# EAGLE schematic motherBoard_Power (EAGLE 9.3.0)

## Sheet 1 of 2
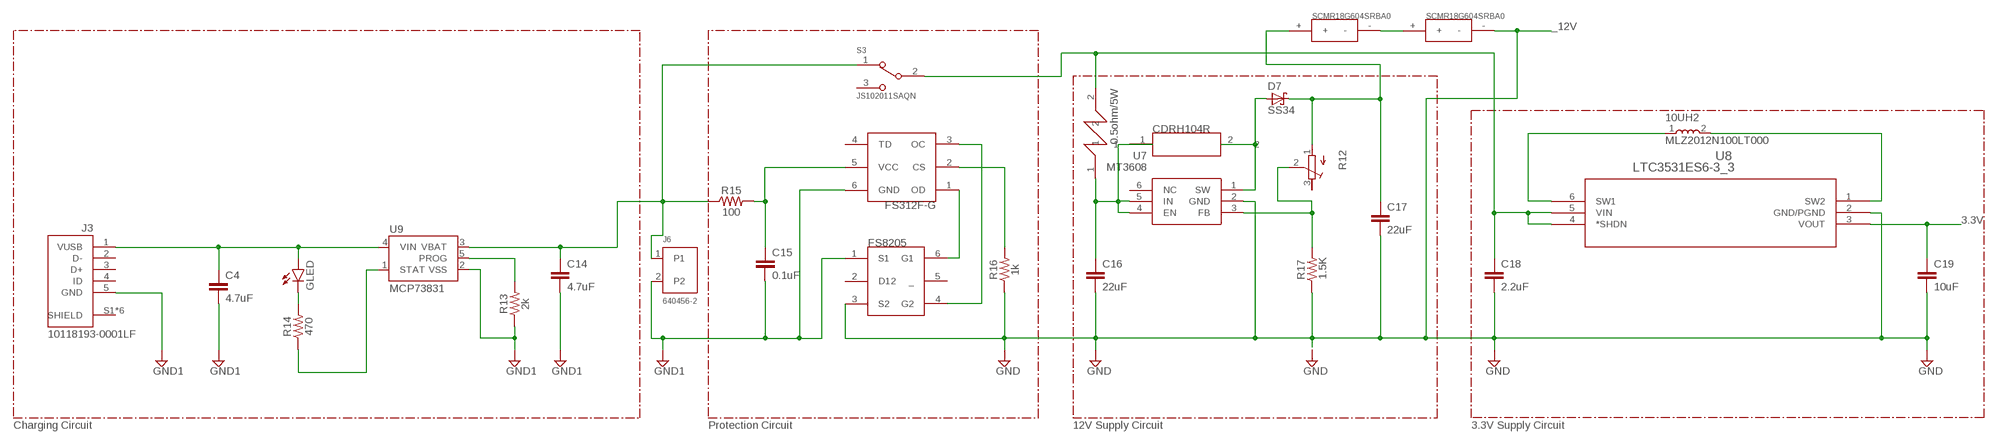
[diagram p0: schematic, sheet 1]

### Parts
10UH2  MLZ2012N100LT000  [INDC2012X125]
C4  4.7uF  10UF-0603-6.3V-20%  [0603]
C14  4.7uF  0.1UF-0603-25V-(+80/-20%)  [0603]
C15  0.1uF  0.1UF-0603-25V-(+80/-20%)  [0603]
C16  22uF  10UF-0603-6.3V-20%  [0603]
C17  22uF  10UF-0603-6.3V-20%  [0603]
C18  2.2uF  2.2UF-0603-10V-20%  [0603]
C19  10uF  10UF-0603-6.3V-20%  [0603]
D7  SS34  [SMB]
GLED  LED5MM  [LED5MM]
J3  10118193-0001LF  [FCI_10118193-0001LF]
J6  640456-2  [TE_640456-2]
R12  R-TRIMM3296P  [RTRIM3296P]
R13  2k  RESISTOR0805  [0805]
R14  470  RESISTOR0603  [0603]
R15  100  RESISTOR0603  [0603]
R16  1k  RESISTOR0603  [0603]
R17  1.5K  RESISTOR0603  [0603]
S3  JS102011SAQN  [SW_JS102011SAQN]
U7  MT3608  [SOT95P280X145-6N]
U8  LTC3531ES6-3_3  [TSOT-23_S6]
U9  MCP73831  [SOT23-5]
U$11  CDRH104R  [220-INDUCTOR]
U$12  FS312F-G  [SOT-23-6]
U$13  FS8205  [SOT-23-6]
U$14  SCMR18G604SRBA0  [SUPERCAP]
U$15  SCMR18G604SRBA0  [SUPERCAP]
U$16  WNER50FET  [RESISTOR]

### Nets
3.3V: C19.1 U8.3(VOUT)
12V1: C17.1 D7.C R12.1(E) U$14.+
_12V: C4.2 C14.2 C15.2 C16.2 C17.2 C18.2 C19.2 J3.5(GND) J6.2 R13.1 R16.1 R17.1 U7.2(GND) U8.2(GND/PGND) U9.2(VSS) U$12.6(GND) U$13.1(S1) U$13.3(S2) U$15.- ; supply symbol labelled GND1, GND
N$14: C15.1 R15.2 U$12.5(VCC)
N$18: C4.1 GLED.A J3.1(VUSB) U9.4(VIN)
N$25: D7.A U7.1(SW) U$11.2
N$26: R12.2(S) R17.2 U7.3(FB)
N$45: 10UH2.1 U8.6(SW1)
N$46: 10UH2.2 U8.1(SW2)
N$47: C18.1 S3.2 U8.4(*SHDN) U8.5(VIN) U$16.2
N$48: R14.1 U9.1(STAT)
N$49: C14.1 J6.1 R15.1 S3.1 U9.3(VBAT)
N$50: R13.2 U9.5(PROG)
N$51: R16.2 U$12.2(CS)
N$52: U$12.1(OD) U$13.6(G1)
N$53: U$12.3(OC) U$13.4(G2)
N$54: GLED.K(C) R14.2
N$55: U$14.- U$15.+
N$56: C16.1 U7.4(EN) U7.5(IN) U$11.1 U$16.1
Unconnected: J3.2(D-) J3.3(D+) J3.4(ID) J3.S1(SHIELD) J3.S2(SHIELD) J3.S3(SHIELD) J3.S4(SHIELD) J3.S5(SHIELD) J3.S6(SHIELD) R12.3(A) S3.3 U7.6(NC) U$12.4(TD) U$13.2(D12) U$13.5(_)

### Notes on the sheet
- Charging Circuit | Protection Circuit | 12V Supply Circuit | 3.3V Supply Circuit

## Sheet 2 of 2
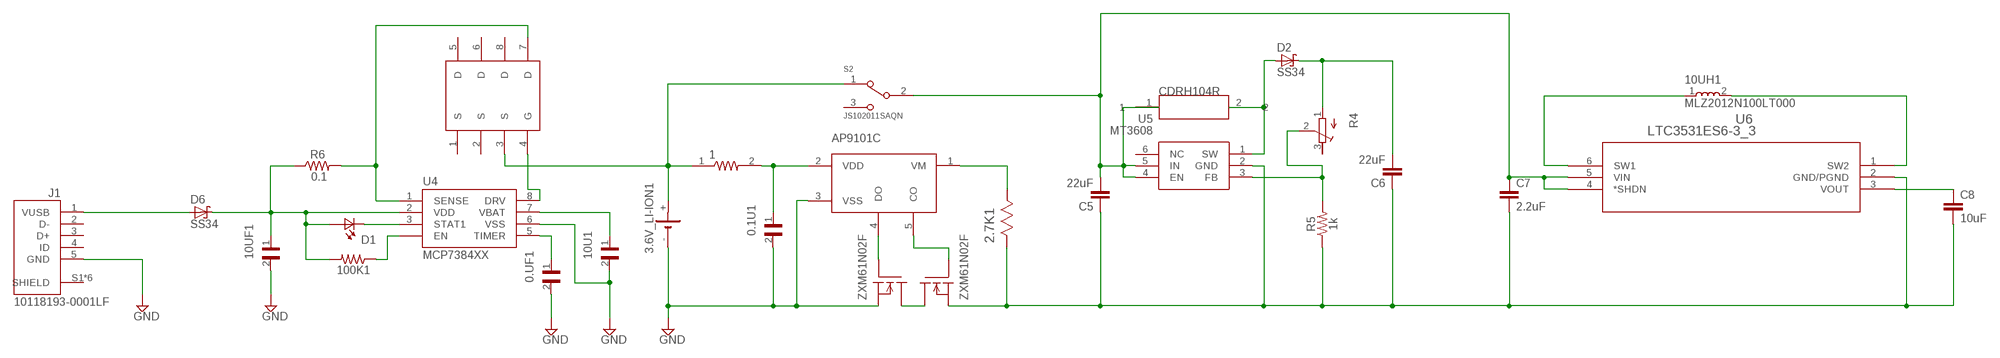
[diagram p1: schematic, sheet 2]

### Parts
0.1U1  C0805C104K4RACTU  [CAPC2012X88N]
0.UF1  C0805C104K4RACTU  [CAPC2012X88N]
1  ERJP6WF3300V  [RESC2012X70]
2.7K1  ERA-6AEB272V  [RESC2013X65N]
3.6V_LI-ION1  SL-160AA/PR  [SL-160AA/PR]
10U1  GRM21BC81C106KE15L  [CAPC2012X135N]
10UF1  GRM21BC81C106KE15L  [CAPC2012X135N]
10UH1  MLZ2012N100LT000  [INDC2012X125]
100K1  CRGH0805J100K  [RESC2012X65N]
C5  22uF  22NF/22,000PF-0603-50V-10%  [0603]
C6  22uF  22NF/22,000PF-0603-50V-10%  [0603]
C7  2.2uF  2.2UF-0603-10V-20%  [0603]
C8  10uF  10UF-0603-6.3V-20%  [0603]
D1  LTST-C191KGKT  [0603]
D2  SS34  [SMB]
D6  SS34  [SMB]
J1  10118193-0001LF  [FCI_10118193-0001LF]
R4  R-TRIMM3296P  [RTRIM3296P]
R5  1k  1KOHM-0603-1/10W-1%  [0603]
R6  0.1  RESISTOR0805  [0805]
S2  JS102011SAQN  [SW_JS102011SAQN]
U4  MCP7384XX  [MSOP8]
U5  MT3608  [SOT95P280X145-6N]
U6  LTC3531ES6-3_3  [TSOT-23_S6]
U$2  NDS8434  [SO08]
U$7  AP9101C  [SOT23-5]
U$8  ZXM61N02F  [SOT23W]
U$9  ZXM61N02F  [SOT23W]
U$10  CDRH104R  [220-INDUCTOR]

### Nets
GND: 0.1U1.2 0.UF1.2 3.6V_LI-ION1.- 10U1.2 10UF1.2 J1.5(GND) U4.6(VSS) U$7.3(VSS) U$8.2(S)
N$1: 10UF1.1 100K1.2 D1.2(A2) D6.C R6.1 U4.2(VDD)
N$13: D1.1(K2) U4.3(STAT1)
N$15: 100K1.1 U4.4(EN)
N$16: R6.2 U4.1(SENSE) U$2.7(D)
N$27: 0.UF1.1 U4.5(TIMER)
N$28: 10U1.1 U4.7(VBAT)
N$29: 1.1 3.6V_LI-ION1.+ S2.1 U$2.3(S)
N$30: U4.8(DRV) U$2.4(G)
N$31: 0.1U1.1 1.2 U$7.2(VDD)
N$32: U$8.3(D) U$9.3(D)
N$33: U$7.4(DO) U$8.1(G)
N$34: U$7.5(CO) U$9.1(G)
N$35: 2.7K1.1(R1) U$7.1(VM)
N$36: 2.7K1.2(R2) C5.1 C6.1 C7.2 C8.2 R5.1 U5.2(GND) U6.2(GND/PGND) U$9.2(S)
N$37: D6.A J1.1(VUSB)
N$38: D2.A U5.1(SW) U$10.2
N$39: R4.2(S) R5.2 U5.3(FB)
N$40: C6.2 D2.C R4.1(E)
N$41: 10UH1.1 U6.6(SW1)
N$42: 10UH1.2 U6.1(SW2)
N$43: C5.2 C7.1 S2.2 U5.4(EN) U5.5(IN) U6.4(*SHDN) U6.5(VIN) U$10.1
N$44: C8.1 U6.3(VOUT)
Unconnected: J1.2(D-) J1.3(D+) J1.4(ID) J1.S1(SHIELD) J1.S2(SHIELD) J1.S3(SHIELD) J1.S4(SHIELD) J1.S5(SHIELD) J1.S6(SHIELD) R4.3(A) S2.3 U5.6(NC) U$2.1(S) U$2.2(S) U$2.5(D) U$2.6(D) U$2.8(D)

## Library data of the parts
0.1U1 0.UF1 = C0805C104K4RACTU:C0805C104K4RACTU: Ceramic Multilayer Capacitor; Capacitor Type:General Purpose; Capacitance:0.01µF; Capacitance Tolerance:± 10%; Voltage Rating:16V; Capacitor Dielectric Type:Multilayer Ceramic; Package/Case:0805; Termination Type:SMD ;RoHS Compliant: Yes; DESCRIPTION: Capacitor; Ceramic; Cap; .100uf ; Tol+10%; Smd; Vol-Rtg 16v; X7r; DIGI-KEY_PART_NUMBER: 399-1167-1-ND; DIGI-KEY_PURCHASE_URL: https://www.digikey.com/product-detail/en/kemet/C0805C104K4RACTU/399-1167-1-ND/411442?utm_source=snapeda&utm_medium=aggregator&utm_campaign=symbol; MF: KEMET; MP: C0805C104K4RACTU; PACKAGE: 0805 Kemet
1 = ERJP6WF3300V:ERJP6WF3300V: RES, THICK FILM, 330R, 1%, 0.5W, 0805, REEL; AVAILABILITY: Unavailable; DESCRIPTION: ERJ Series 0805 330 Ohm ±1% 0.5 W ±200 ppm/°C 2-Side Thick Film Chip Resistor; MF: Panasonic; MP: ERJP6WF3300V; PACKAGE: 0805 Panasonic; PRICE: None
2.7K1 = ERA-6AEB272V:ERA-6AEB272V: RESISTOR, 0805; DESCRIPTION: Res Thin Film 0805 2.7K Ohm 0.1% 0.125W_1/8W_ Ø¢Â±25ppm/Ø¢Â°C Molded SMD Automotive Punched T/R; DIGI-KEY_PART_NUMBER: P2.7KDACT-ND; DIGI-KEY_PURCHASE_URL: https://www.digikey.com/product-detail/en/panasonic-electronic-components/ERA-6AEB272V/P2.7KDACT-ND/1465957?utm_source=snapeda&utm_medium=aggregator&utm_campaign=symbol; MF: Panasonic; MP: ERA-6AEB272V; PACKAGE: 0805 Panasonic
3.6V_LI-ION1 = battery:SL-160AA/PR: LI BATTERY Sonnenschein
10U1 10UF1 = GRM21BC81C106KE15L:GRM21BC81C106KE15L: Cap Ceramic 10uF 16V X6S 10% SMD 0805 105C T/R; DESCRIPTION: 0805 10 uF 16V ±10% Tolerance X6S SMT Multilayer Ceramic Capacitor; DIGI-KEY_PART_NUMBER: 490-10498-1-ND; DIGI-KEY_PURCHASE_URL: https://www.digikey.com/product-detail/en/murata-electronics-north-america/GRM21BC81C106KE15L/490-10498-1-ND/5026423?utm_source=snapeda&utm_medium=aggregator&utm_campaign=symbol; MF: Murata; MP: GRM21BC81C106KE15L; PACKAGE: 0805 Murata
10UH1 10UH2 = MLZ2012N100LT000:MLZ2012N100LT000: Surface Mount High Frequency Inductor, MLZ Series, 10 H, 20%, 0805 [2012 Metric], 0.3 ohm; DESCRIPTION: Surface Mount High Frequency Inductor, MLZ Series, 10 H, 20%, 0805 [2012 Metric], 0.3 ohm; DIGI-KEY_PART_NUMBER: 445-6762-1-ND; DIGI-KEY_PURCHASE_URL: https://www.digikey.com/product-detail/en/tdk-corporation/MLZ2012N100LT000/445-6762-1-ND/2523583?utm_source=snapeda&utm_medium=aggregator&utm_campaign=symbol; MF: TDK; MP: MLZ2012N100LT000; PACKAGE: 0805 TDK
100K1 = CRGH0805J100K:CRGH0805J100K: CRGH Series Resistor 0805 5% 100K 0.33W; AVAILABILITY: Unavailable; COMMENT: 2-1879496-3; DESCRIPTION: CRGH0805 5% 100K 0.33W; EU_ROHS_COMPLIANCE: Compliant with Exemptions; MF: TE Connectivity; MP: CRGH0805J100K; PACKAGE: 0805; POWER_RATING: .33 W; PRICE: None; RESISTANCE: 100K; TE_PURCHASE_URL: https://www.te.com/usa-en/product-2-1879496-3.html?te_bu=Cor&te_type=disp&te_campaign=seda_glo_cor-seda-global-disp-prtnr-fy19-seda-model-bom-cta_sma-317_1&elqCampaignId=32493; TOLERANCE: 5%; VOLTAGE_RATING: 150 V
C4 C16 C17 = SparkFun-Capacitors:10UF: 10.0µF ceramic capacitors A capacitor is a passive two-terminal electrical component used to store electrical energy temporarily in an electric field.; PROD_ID: CAP-11015; VALUE: 10uF
C5 C6 = SparkFun-Capacitors:22NF/22,000PF: 0.022uF/22nF/22,000pF ceramic capacitors A capacitor is a passive two-terminal electrical component used to store electrical energy temporarily in an electric field.; PROD_ID: CAP-07885; VALUE: 22nF
C7 C18 = SparkFun-Capacitors:2.2UF: 2.2µF ceramic capacitors A capacitor is a passive two-terminal electrical component used to store electrical energy temporarily in an electric field.; PROD_ID: CAP-07888
C8 C19 = SparkFun-Capacitors:10UF: 10.0µF ceramic capacitors A capacitor is a passive two-terminal electrical component used to store electrical energy temporarily in an electric field.; PROD_ID: CAP-11015
C14 = SparkFun-Capacitors:0.1UF: 0.1µF ceramic capacitors A capacitor is a passive two-terminal electrical component used to store electrical energy temporarily in an electric field.; PROD_ID: CAP-00810; VALUE: 0.1uF
C15 = SparkFun-Capacitors:0.1UF: 0.1µF ceramic capacitors A capacitor is a passive two-terminal electrical component used to store electrical energy temporarily in an electric field.; PROD_ID: CAP-00810
D1 = LTST-C191KGKT:LTST-C191KGKT: http://octopart.com/ltst-c190krkt-lite-on-549893; DESCRIPTION: Green 1.6 x 0.8 x 0.55 mm 130º Water Clear 35 mcd Surface Mount LED; DIGI-KEY_PART_NUMBER: 160-1446-1-ND; DIGI-KEY_PURCHASE_URL: https://www.digikey.com/product-detail/en/lite-on-inc/LTST-C191KGKT/160-1446-1-ND/386834?utm_source=snapeda&utm_medium=aggregator&utm_campaign=symbol; MF: Lite-On Inc.; MP: LTST-C191KGKT; PACKAGE: 0603 Lite-On
D2 D6 D7 = SS34:SS34: 3A 40V Schottky diode; AVAILABILITY: Unavailable; DESCRIPTION: SS Series 500 mV 3 A 40 V Max Reverse Voltage Schottky Rectifier - DO-214AB; MF: ON Semiconductor; MP: SS34; PACKAGE: DO-214 ON Semiconductor; PRICE: None
GLED = led:LED: LED OSRAM: - CHIPLED LG R971, LG N971, LY N971, LG Q971, LY Q971, LO R971, LY R971 LH N974, LH R974 LS Q976, LO Q976, LY Q976 LO Q996 - Hyper CHIPLED LW Q18S LB Q993, LB Q99A, LB R99A - SideLED LS A670, LO A670, LY A670, LG A670, LP A670 LB A673, LV A673, LT A673, LW A673 LH A674 LY A675 LS A676, LA A676, LO A676, LY A676, LW A676 LS A679, LY A679, LG A679 - Hyper Micro SIDELED® LS Y876, LA Y876, LO Y876, LY Y876 LT Y87S - SmartLED LW L88C, LW L88S LB L89C, LB L89S, LG L890 LS L89K, LO L89K, LY L89K LS L896, LA L896, LO L896, LY L896 - TOPLED LS T670, LO T670, LY T670, LG T670, LP T670 LSG T670, LSP T670, LSY T670, LOP T670, LYG T670 LG T671, LOG T671, LSG T671 LB T673, LV T673, LT T673, LW T673 LH T674 LS T676, LA T676, LO T676, LY T676, LB T676, LH T676, LSB T676, LW T676 LB T67C, LV T67C, LT T67C, LS T67K, LO T67K, LY T67K, LW E67C LS E67B, LA E67B, LO E67B, LY E67B, LB E67C, LV E67C, LT E67C LW T67C LS T679, LY T679, LG T679 LS T770, LO T770, LY T770, LG T770, LP T770 LB T773, LV T773, LT T773, LW T773 LH T774 LS E675, LA E675, LY E675, LS T675 LS T776, LA T776, LO T776, LY T776, LB T776 LHGB T686 LT T68C, LB T68C - Hyper Mini TOPLED® LB M676 - Mini TOPLED Santana® LG M470 LS M47K, LO M47K, LY M47K Source: http://www.osram.convergy.de LUXEON: - LUMILED® LXK2-PW12-R00, LXK2-PW12-S00, LXK2-PW14-U00, LXK2-PW14-V00 LXK2-PM12-R00, LXK2-PM12-S00, LXK2-PM14-U00 LXK2-PE12-Q00, LXK2-PE12-R00, LXK2-PE12-S00, LXK2-PE14-T00, LXK2-PE14-U00 LXK2-PB12-K00, LXK2-PB12-L00, LXK2-PB12-M00, LXK2-PB14-N00, LXK2-PB14-P00, LXK2-PB14-Q00 LXK2-PR12-L00, LXK2-PR12-M00, LXK2-PR14-Q00, LXK2-PR14-R00 LXK2-PD12-Q00, LXK2-PD12-R00, LXK2-PD12-S00 LXK2-PH12-R00, LXK2-PH12-S00 LXK2-PL12-P00, LXK2-PL12-Q00, LXK2-PL12-R00 Source: www.luxeon.com KINGBRIGHT: KA-3528ASYC Source: www.kingbright.com
J1 J3 = 10118193-0001LF:10118193-0001LF: Micro USB B Type Receptacle; DESCRIPTION: Single Port 5 Contact Shielded SMT MICRO USB B-Type Receptacle; DIGI-KEY_PART_NUMBER: 609-4616-1-ND; DIGI-KEY_PURCHASE_URL: https://www.digikey.com/product-detail/en/amphenol-icc-fci/10118193-0001LF/609-4616-1-ND/2785380?utm_source=snapeda&utm_medium=aggregator&utm_campaign=symbol; MF: Amphenol ICC; MP: 10118193-0001LF; PACKAGE: None
J6 = 640456-2:640456-2: CONN HEADER VERT 2POS .100 TIN; COMMENT: 640456-2; DESCRIPTION: 02P MTA100 HDR ASSY F/L SQ STR; DIGI-KEY_PART_NUMBER: A1921-ND; DIGI-KEY_PURCHASE_URL: https://www.digikey.com/product-detail/en/te-connectivity-amp-connectors/640456-2/A1921-ND/109003?utm_source=snapeda&utm_medium=aggregator&utm_campaign=symbol; EU_ROHS_COMPLIANCE: Compliant; MF: TE Connectivity; MP: 640456-2; PACKAGE: None; TE_PURCHASE_URL: https://www.te.com/usa-en/product-640456-2.html?te_bu=Cor&te_type=disp&te_campaign=seda_glo_cor-seda-global-disp-prtnr-fy19-seda-model-bom-cta_sma-317_1&elqCampaignId=32493
R4 R12 = rcl:R-TRIMM: Trimm resistor
R5 = SparkFun-Resistors:1KOHM: 1kΩ resistor A resistor is a passive two-terminal electrical component that implements electrical resistance as a circuit element. Resistors act to reduce current flow, and, at the same time, act to lower voltage levels within circuits. - Wikipedia; PROD_ID: RES-07856
R6 R13-R17 = SparkFun-Resistors:RESISTOR: Generic Resistor Package
S2 S3 = JS102011SAQN:JS102011SAQN: JS10 Series SPDT On-On 6 V 0.3 A Gull Wing SMT Slide Switch http://www.snapeda.com/parts/JS102011SAQN/C%26K%20Components/view-part/; DESCRIPTION: JS10 Series SPDT On-On 6 V 0.3 A Gull Wing SMT Slide Switch; DIGI-KEY_PART_NUMBER: 401-1999-1-ND; DIGI-KEY_PURCHASE_URL: https://www.digikey.com/product-detail/en/c-k/JS102011SAQN/401-1999-1-ND/1640114?utm_source=snapeda&utm_medium=aggregator&utm_campaign=symbol; MF: C&K; MP: JS102011SAQN; PACKAGE: None
U4 = SparkFun-IC-Power:MCP7384XX: Li-Ion charge controller family from Microchip (IC-08344)
U5 U7 = MT3608:MT3608: High Efficiency 1.2MHz 2A Step Up Converter Source: Datasheet <https://www.olimex.com/Products/Breadboarding/BB-PWR-3608/resources/MT3608.pdf>; ARROW_PART_NUMBER: MT3608; DESCRIPTION: High Efficiency 1.2MHz 2A Step Up Converter; HEIGHT: 1.45mm; MANUFACTURER_NAME: Aerosemi; MANUFACTURER_PART_NUMBER: MT3608
U6 U8 = LTC3531ES6-3_3:LTC3531ES6-3_3; AVAILABILITY: Unavailable; DESCRIPTION: LTC3531 - 200mA Buck-Boost Synchronous DC/DC Converters; MF: Linear Technology; MP: LTC3531ES6-3.3; PACKAGE: None; PRICE: None
U9 = SparkFun-IC-Power:MCP73831: MCP73831T Li-Ion, Li-Pol Controller Miniature single cell, fully integrated Li-Ion, Li-polymer charge management controller Datasheet <http://ww1.microchip.com/downloads/en/DeviceDoc/20001984g.pdf> SparkFun Products: SparkFun ESP32 Thing <https://www.sparkfun.com/products/13907> SparkFun 9DoF Razor IMU M0 <https://www.sparkfun.com/products/14001>; PROD_ID: IC-09995
U$2 = NDS8434:NDS8434: 8-SOIC NMOSFET; AVAILABILITY: Unavailable; DESCRIPTION: P-Channel 20 V 0.035 Ohm Surface Mount Field Effect Transistor - SOIC-8; MF: ON Semiconductor; MP: NDS8434; PACKAGE: SO-8 ON Semiconductor; PRICE: None
U$7 = AP910C:AP9101C: AP9101CAK-ABTRG1 Protection IC Chip The AP9101C is a protection IC designed with high precision voltage detection circuit. The AP9101C provides a function to protect batteries by detecting overcharge voltage, overdischarge voltage, overcharge current, overdischarge current and other abnormalities and turning off the external MOSFET switch. The AP9101C also has a built-in fixed time circuit (external capacitors are unnecessary), the protection circuitry can be comprised with fewer external components.
U$8 U$9 = ZXM61N02F:ZXM61N02F: N-Ch Enhancement MOSFET, Logic Level (SOT23); AVAILABILITY: Unavailable; DESCRIPTION: N CHANNEL MOSFET, 20V, 1.7A, SOT-23; Transistor Polarity: N Channel; Continuous Drain Current Id: 1.7A; Drain Source ...; MF: Diodes Inc.; MP: ZXM61N02F; PACKAGE: SOT-23-3 Diodes Inc.; PRICE: None
U$10 U$11 = CDRH104R:CDRH104R: CDRH104C: Ferrite drum core construction. • Magnetically shielded. • L×W×H:10.5×10.3×4.0mm Max. • Product weight: 1.5g(Ref.) • Moisture Sensitivity Level: 1 • RoHS compliance. • Halogen Free available.
U$12 = FS312F-G:FS312F-G
U$13 = FS8205:FS8205
U$14 U$15 = SCMRCapacitor:SCMR18G604SRBA0: SCMR18G604SRBA0: 0.6F/7.5V/1.77A
U$16 = WNER50FET:WNER50FET: WNER50FET: 0.5ohm, 5W Resistor for 12V DC-DC Converter